# EAGLE schematic 85-2031 (EAGLE 6.6.0)
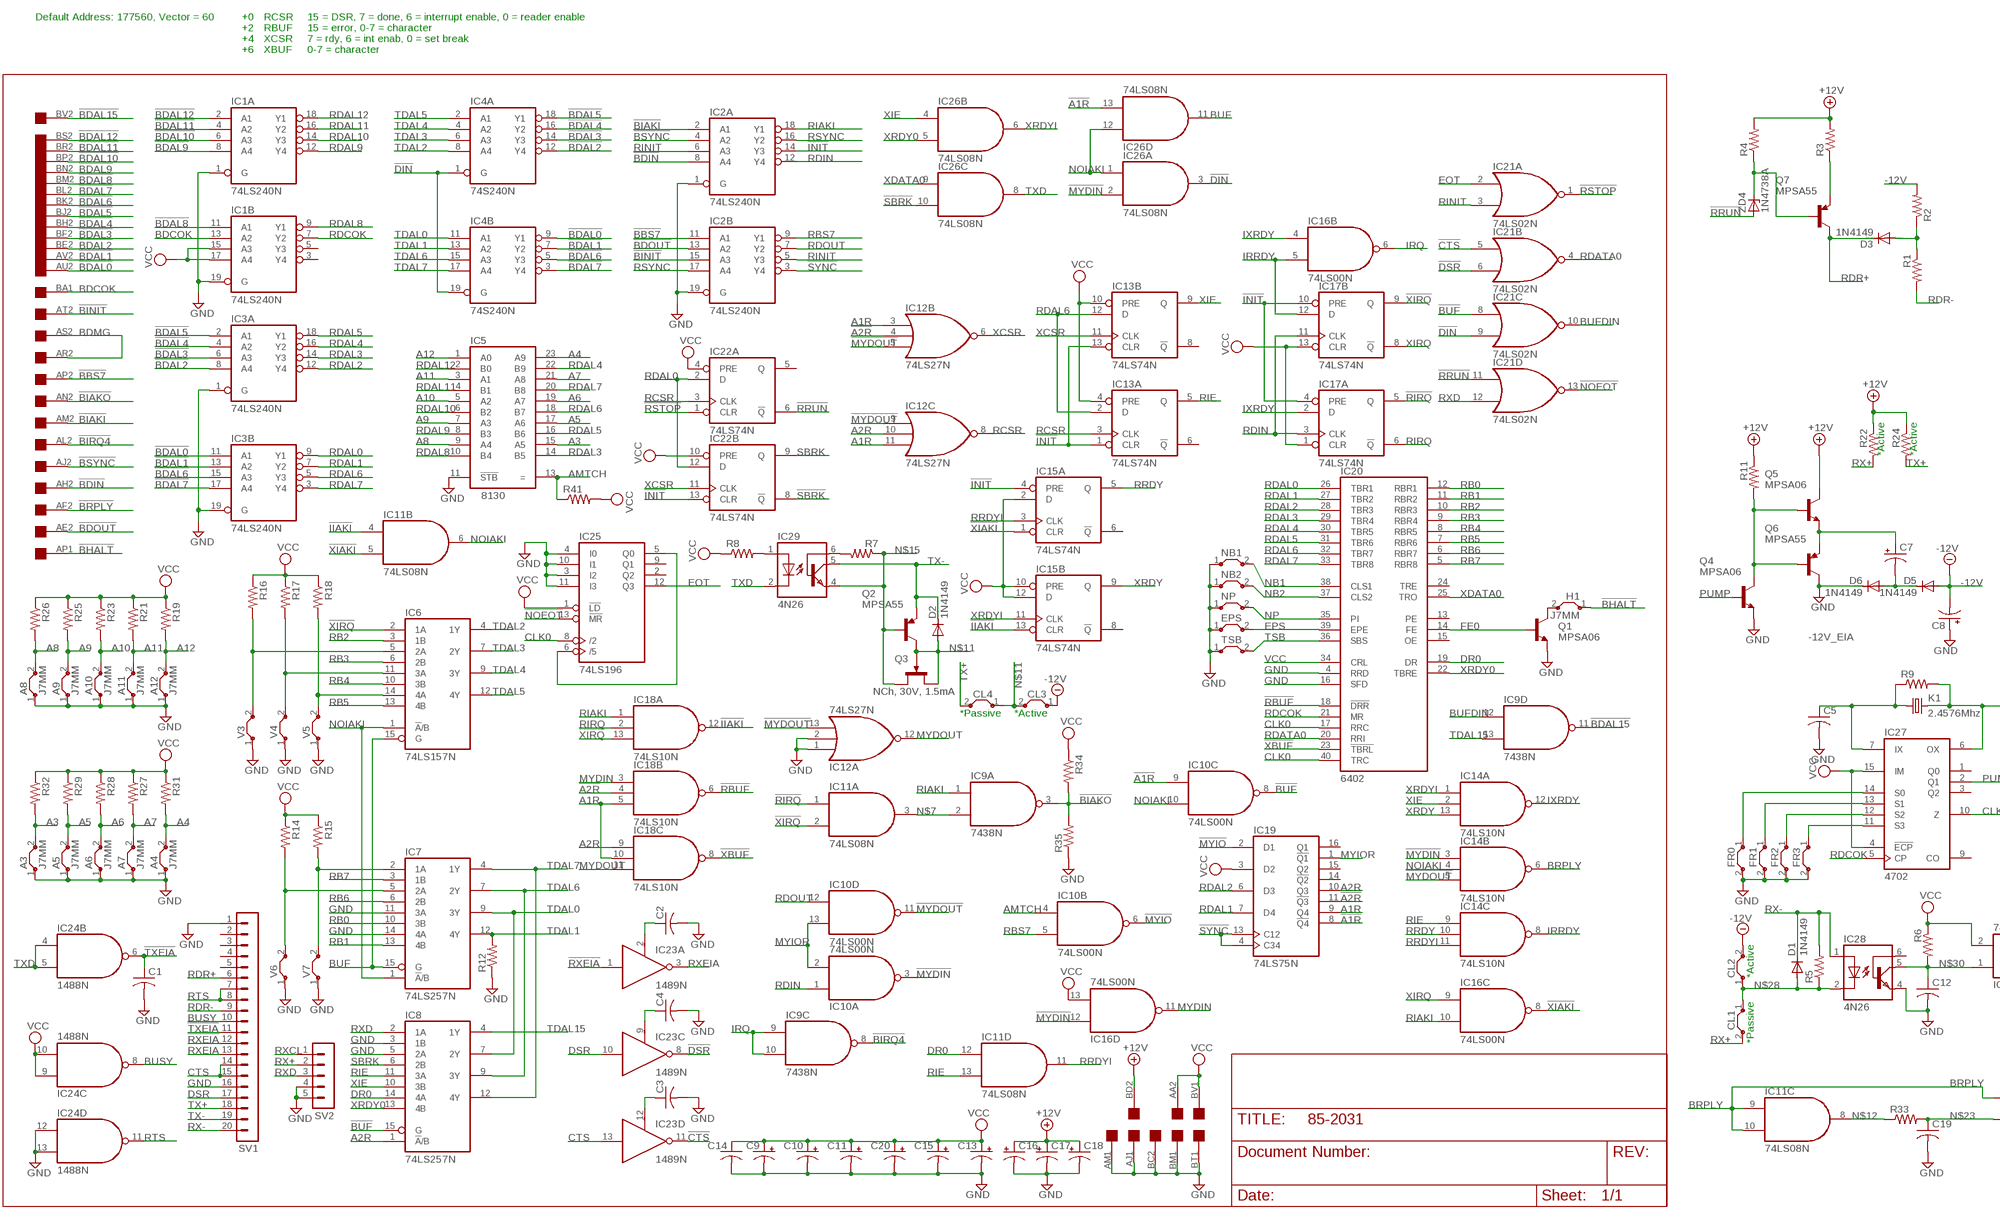
[diagram p0: schematic, sheet 1, part 1 of 2]
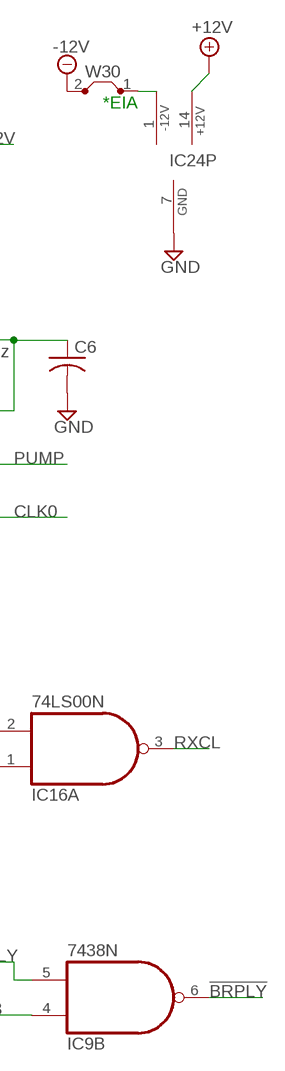
[diagram p1: schematic, sheet 1, part 2 of 2]

## Parts
A3  J7MM  [07]
A4  J7MM  [07]
A5  J7MM  [07]
A6  J7MM  [07]
A7  J7MM  [07]
A8  J7MM  [07]
A9  J7MM  [07]
A10  J7MM  [07]
A11  J7MM  [07]
A12  J7MM  [07]
C1  C-US075-032X103  [C075-032X103]
C2  C-US075-032X103  [C075-032X103]
C3  C-US075-032X103  [C075-032X103]
C4  C-US075-032X103  [C075-032X103]
C5  C-US075-032X103  [C075-032X103]
C6  C-US075-032X103  [C075-032X103]
C7  CPOL-USB45181B  [B45181B]
C8  CPOL-USB45181B  [B45181B]
C9  CPOL-USB45181B  [B45181B]
C10  CPOL-USB45181B  [B45181B]
C11  CPOL-USB45181B  [B45181B]
C12  C-US075-032X103  [C075-032X103]
C13  CPOL-USB45181B  [B45181B]
C14  C-US075-032X103  [C075-032X103]
C15  CPOL-USB45181B  [B45181B]
C16  CPOL-USB45181B  [B45181B]
C17  CPOL-USB45181B  [B45181B]
C18  CPOL-USB45181B  [B45181B]
C19  C-US075-032X103  [C075-032X103]
C20  CPOL-USB45181B  [B45181B]
CL1  J7MM  [07]
CL2  J7MM  [07]
CL3  J7MM  [07]
CL4  J7MM  [07]
D1  1N4149  1N4148DO35-10  [DO35-10]
D2  1N4149  1N4148DO35-10  [DO35-10]
D3  1N4149  1N4148DO35-10  [DO35-10]
D5  1N4149  1N4148DO35-10  [DO35-10]
D6  1N4149  1N4148DO35-10  [DO35-10]
EDGE$  DOUBLE  [EDGE-CON4]
EPS  J7MM  [07]
FR0  J7MM  [07]
FR1  J7MM  [07]
FR2  J7MM  [07]
FR3  J7MM  [07]
H1  J7MM  [07]
IC1  74LS240N  [DIL20]
IC2  74LS240N  [DIL20]
IC3  74LS240N  [DIL20]
IC4  74S240N  [DIL20]
IC5  8130  [DIL24]
IC6  74LS157N  [DIL16]
IC7  74LS257N  [DIL16]
IC8  74LS257N  [DIL16]
IC9  7438N  74LS38N  [DIL14]
IC10  74LS00N  [DIL14]
IC11  74LS08N  [DIL14]
IC12  74LS27N  [DIL14]
IC13  74LS74N  [DIL14]
IC14  74LS10N  [DIL14]
IC15  74LS74N  [DIL14]
IC16  74LS00N  [DIL14]
IC17  74LS74N  [DIL14]
IC18  74LS10N  [DIL14]
IC19  74LS75N  [DIL16]
IC20  6402  HD6402  [DIL40]
IC21  74LS02N  [DIL14]
IC22  74LS74N  [DIL14]
IC23  1489N  [DIL14]
IC24  1488N  [DIL14]
IC25  74LS196  [DIL14]
IC26  74LS08N  [DIL14]
IC27  4702  HD4702  [DIL16]
IC28  4N26  4N35  [DIL06]
IC29  4N26  4N35  [DIL06]
K1  2.4576Mhz  CRYSTALHC33U-H  [HC33U-H]
NB1  J7MM  [07]
NB2  J7MM  [07]
NP  J7MM  [07]
Q1  MPSA06  -NPN-TO92L  [TO92L]
Q2  MPSA55  -PNP-TO92L  [TO92L]
Q3  NCh, 30V, 1.5mA  2N4391  [TO18E]
Q4  MPSA06  -NPN-TO92L  [TO92L]
Q5  MPSA06  -NPN-TO92L  [TO92L]
Q6  MPSA55  -PNP-TO92L  [TO92L]
Q7  MPSA55  -PNP-TO92L  [TO92L]
R1  R-US_0207/10  [0207/10]
R2  R-US_0207/10  [0207/10]
R3  R-US_0207/10  [0207/10]
R4  R-US_0207/10  [0207/10]
R5  R-US_0207/10  [0207/10]
R6  R-US_0207/10  [0207/10]
R7  R-US_0207/10  [0207/10]
R8  R-US_0207/10  [0207/10]
R9  R-US_0207/10  [0207/10]
R11  R-US_0411/12  [0411/12]
R12  R-US_0207/10  [0207/10]
R14  R-US_0207/10  [0207/10]
R15  R-US_0207/10  [0207/10]
R16  R-US_0207/10  [0207/10]
R17  R-US_0207/10  [0207/10]
R18  R-US_0207/10  [0207/10]
R19  R-US_0207/10  [0207/10]
R21  R-US_0207/10  [0207/10]
R22  R-US_0207/10  [0207/10]
R23  R-US_0207/10  [0207/10]
R24  R-US_0207/10  [0207/10]
R25  R-US_0207/10  [0207/10]
R26  R-US_0207/10  [0207/10]
R27  R-US_0207/10  [0207/10]
R28  R-US_0207/10  [0207/10]
R29  R-US_0207/10  [0207/10]
R31  R-US_0207/10  [0207/10]
R32  R-US_0207/10  [0207/10]
R33  R-US_0207/10  [0207/10]
R34  R-US_0207/10  [0207/10]
R35  R-US_0207/10  [0207/10]
R41  R-US_0207/10  [0207/10]
SV1  MA20-1  [MA20-1]
SV2  MA05-1  [MA05-1]
TSB  J7MM  [07]
V3  J7MM  [07]
V4  J7MM  [07]
V5  J7MM  [07]
V6  J7MM  [07]
V7  J7MM  [07]
W30  J7MM  [07]
ZD4  1N4738A  1N4728  [DO41Z10]

## Nets
!A1R: IC10.9(C:I0) IC19.8(!Q4) IC26.13(D:I1)
!A2R: IC12.4(B:I1) IC18.4(B:I1) IC19.11(!Q3)
!BBS7: EDGE$.AP2 IC2.11(B:A1)
!BDAL0: EDGE$.AU2 IC3.11(B:A1) IC4.9(B:Y1)
!BDAL1: EDGE$.AV2 IC3.13(B:A2) IC4.7(B:Y2)
!BDAL2: EDGE$.BE2 IC3.8(A:A4) IC4.12(A:Y4)
!BDAL3: EDGE$.BF2 IC3.6(A:A3) IC4.14(A:Y3)
!BDAL4: EDGE$.BH2 IC3.4(A:A2) IC4.16(A:Y2)
!BDAL5: EDGE$.BJ2 IC3.2(A:A1) IC4.18(A:Y1)
!BDAL6: EDGE$.BK2 IC3.15(B:A3) IC4.5(B:Y3)
!BDAL7: EDGE$.BL2 IC3.17(B:A4) IC4.3(B:Y4)
!BDAL8: EDGE$.BM2 IC1.11(B:A1)
!BDAL9: EDGE$.BN2 IC1.8(A:A4)
!BDAL10: EDGE$.BP2 IC1.6(A:A3)
!BDAL11: EDGE$.BR2 IC1.4(A:A2)
!BDAL12: EDGE$.BS2 IC1.2(A:A1)
!BDAL15: EDGE$.BV2 IC9.11(D:O)
!BDIN: EDGE$.AH2 IC2.8(A:A4)
!BDOUT: EDGE$.AE2 IC2.13(B:A2)
!BHALT: EDGE$.AP1 H1.1
!BIAKI: EDGE$.AM2 IC2.2(A:A1)
!BIAKO: EDGE$.AN2 IC9.3(A:O) R34.2 R35.2
!BINIT: EDGE$.AT2 IC2.15(B:A3)
!BIRQ4: EDGE$.AL2 IC9.8(C:O)
!BRPLY: EDGE$.AF2 IC9.6(B:O)
!BSYNC: EDGE$.AJ2 IC2.4(A:A2)
!BUF: IC8.15(G) IC10.8(C:O) IC21.8(C:I0)
!CTS: IC21.5(B:I0) IC23.11(D:O)
!DIN: IC4.1(A:G) IC4.19(B:G) IC21.9(C:I1) IC26.3(A:O)
!DSR: IC21.6(B:I1) IC23.8(C:O)
!IIAKI: IC11.4(B:I0) IC15.13(B:CLR) IC18.12(A:O)
!INIT: IC2.14(A:Y3) IC13.1(A:CLR) IC13.13(B:CLR) IC15.4(A:PRE) IC17.4(A:PRE) IC17.10(B:PRE) IC22.13(B:CLR)
!MYDIN: IC10.3(A:O) IC14.3(B:I0) IC16.12(D:I0) IC26.2(A:I1)
!MYDOUT: IC10.11(D:O) IC12.5(B:I2) IC12.9(C:I0) IC12.13(A:I2) IC14.5(B:I2)
!MYIO: IC10.6(B:O) IC19.2(D1)
!NOEOT: IC21.13(D:O) IC25.13(!MR)
!RBUF: IC18.6(B:O) IC20.18(!DRR)
!RIRQ: IC11.1(A:I0) IC17.5(A:Q)
!RRUN: IC21.11(D:I0) IC22.6(A:!Q) ZD4.A
!RSTOP: IC21.1(A:O) IC22.1(A:CLR)
!RXEIA: IC23.1(A:I) SV1.12
!SBRK: IC22.8(B:!Q) IC26.10(C:I1)
!SYNC: IC2.3(B:Y4) IC19.4(C34) IC19.13(C12)
!TXEIA: C1.1 IC24.6(B:O) SV1.11
!XBUF: IC18.8(C:O) IC20.23(!TBRL)
!XIAKI: IC11.5(B:I1) IC15.1(A:CLR) IC16.8(C:O)
!XIRQ: IC6.2(1A) IC11.2(A:I1) IC17.9(B:Q) IC18.13(A:I2)
+12V [Supply]: C16.+ C17.+ C18.+ EDGE$.BD2 IC24.14(P:+12V) Q5.3(C) R3.2 R4.2 R11.1 R22.1 R24.1
-12V: C8.- CL2.2 CL3.1 D5.A R2.2 W30.2
-12V_EIA: IC24.1(P:-12V) W30.1
A1R: IC12.3(B:I0) IC12.11(C:I2) IC18.5(B:I2) IC18.10(C:I1) IC19.9(Q4)
A2R: IC8.1(!A!/B) IC12.10(C:I1) IC18.9(C:I0) IC19.10(Q3)
A3: A3.2 IC5.15(A5) R32.2
A4: A4.2 IC5.23(A9) R31.2
A5: A5.2 IC5.17(A6) R29.2
A6: A6.2 IC5.19(A7) R28.2
A7: A7.2 IC5.21(A8) R27.2
A8: A8.2 IC5.9(A4) R26.2
A9: A9.2 IC5.7(A3) R25.2
A10: A10.2 IC5.5(A2) R23.2
A11: A11.2 IC5.3(A1) R21.2
A12: A12.2 IC5.1(A0) R19.2
AMTCH: IC5.13(=) IC10.4(B:I0) R41.1
BDCOK: EDGE$.BA1 IC1.13(B:A2)
BDMG: EDGE$.AR2 EDGE$.AS2
BRPLY: IC9.5(B:I1) IC11.9(C:I0) IC11.10(C:I1) IC14.6(B:O)
BUF: IC6.15(G) IC7.15(G) IC26.11(D:O)
BUFDIN: IC9.12(D:I0) IC21.10(C:O)
BUSY: IC24.8(C:O) SV1.10
CLK0: IC20.17(RRC) IC20.40(TRC) IC25.8(/2) IC27.10(Z)
CTS: IC23.13(D:I) SV1.14 SV1.15
DR0: IC8.14(4A) IC11.12(D:I0) IC20.19(DR)
DSR: IC23.10(C:I) SV1.17
EOT: IC21.2(A:I0) IC25.12(Q3)
EPS: EPS.2 IC20.39(EPE)
FE0: IC20.14(FE) Q1.2(B)
GND [Supply]: A3.1 A4.1 A5.1 A6.1 A7.1 A8.1 A9.1 A10.1 A11.1 A12.1 C1.2 C2.2 C3.2 C4.2 C5.2 C6.2 C8.+ C9.- C10.- C11.- C12.2 C13.- C14.2 C15.- C16.- C17.- C18.- C19.2 C20.- D6.C EDGE$.AJ1 EDGE$.AM1 EDGE$.BC2 EDGE$.BM1 EDGE$.BT1 EPS.1 FR0.2 FR1.2 FR2.2 FR3.2 IC1.1(A:G) IC1.19(B:G) IC2.1(A:G) IC2.19(B:G) IC3.1(A:G) IC3.19(B:G) IC5.11(!STB) IC7.11(3A) IC7.14(4A) IC8.3(1B) IC8.5(2A) IC12.1(A:I0) IC12.2(A:I1) IC20.4(RRD) IC20.16(SFD) IC24.7(P:GND) IC24.12(D:I0) IC24.13(D:I1) IC25.3(I2) IC25.4(I0) IC25.10(I1) IC25.11(I3) IC28.4(EMI) NB1.1 NB2.1 NP.1 Q1.1(E) Q4.1(E) Q6.3(C) R12.1 R35.1 SV1.1 SV1.16 SV2.4 SV2.5 TSB.1 V3.1 V4.1 V5.1 V6.1 V7.1
IRQ: IC9.9(C:I0) IC9.10(C:I1) IC16.6(B:O)
IRRDY: IC14.8(C:O) IC16.5(B:I1) IC17.12(B:D)
IXRDY: IC14.12(A:O) IC16.4(B:I0) IC17.2(A:D)
MYDIN: IC16.11(D:O) IC18.3(B:I0)
MYDOUT: IC12.12(A:O) IC18.11(C:I2)
MYIOR: IC10.2(A:I1) IC10.13(D:I1) IC19.1(!Q1)
N$1: C2.1 IC23.2(A:RC)
N$2: FR0.1 IC27.14(S0)
N$3: H1.2 Q1.3(C)
N$4: FR1.1 IC27.13(S1)
N$5: FR2.1 IC27.12(S2)
N$6: FR3.1 IC27.11(S3)
N$7: IC9.2(A:I1) IC11.3(A:O)
N$8: IC6.14(4A) R18.2 V5.2
N$9: C5.1 IC27.7(IX) K1.1 R9.1
N$10: C6.1 IC27.6(OX) K1.2 R9.2
N$11: CL3.2 CL4.1 D2.A Q2.3(C) Q3.D Q3.G
N$12: IC11.8(C:O) R33.1
N$13: IC29.6(BAS) R7.2
N$15: IC29.4(EMI) Q2.2(B) Q3.S R7.1
N$16: IC29.1(A) R8.2
N$17: IC7.2(1A) R15.2 V7.2
N$18: IC7.5(2A) R14.2 V6.2
N$19: C4.1 IC23.9(C:RC)
N$20: C7.- D5.C D6.A
N$21: IC6.11(3A) R17.2 V4.2
N$22: C7.+ Q5.1(E) Q6.1(E)
N$23: C19.1 IC9.4(B:I0) R33.2
N$24: IC6.5(2A) R16.2 V3.2
N$25: C3.1 IC23.12(D:RC)
N$26: Q4.3(C) Q5.2(B) Q6.2(B) R11.2
N$27: D3.A R1.1 R2.1
N$28: CL1.1 CL2.1 D1.A IC28.2(C) R5.1
N$29: Q7.2(B) R4.1 ZD4.C
N$30: C12.1 IC16.1(A:I0) IC28.5(COL) R6.2
N$31: Q7.1(E) R3.1
N$32: IC25.5(Q0) IC25.6(/5)
NB1: IC20.38(CLS1) NB1.2
NB2: IC20.37(CLS2) NB2.2
NOIAKI: IC6.1(!A!/B) IC7.1(!A!/B) IC10.10(C:I1) IC11.6(B:O) IC14.4(B:I1) IC26.1(A:I0) IC26.12(D:I0)
NP: IC20.35(PI) NP.2
PUMP: IC27.2(Q1) Q4.2(B)
RB0: IC7.10(3B) IC20.12(RBR1)
RB1: IC7.13(4B) IC20.11(RBR2)
RB2: IC6.3(1B) IC20.10(RBR3)
RB3: IC6.6(2B) IC20.9(RBR4)
RB4: IC6.10(3B) IC20.8(RBR5)
RB5: IC6.13(4B) IC20.7(RBR6)
RB6: IC7.6(2B) IC20.6(RBR7)
RB7: IC7.3(1B) IC20.5(RBR8)
RBS7: IC2.9(B:Y1) IC10.5(B:I1)
RCSR: IC12.8(C:O) IC13.3(A:CLK) IC22.3(A:CLK)
RDAL0: IC3.9(B:Y1) IC20.26(TBR1) IC22.2(A:D) IC22.12(B:D)
RDAL1: IC3.7(B:Y2) IC19.7(D4) IC20.27(TBR2)
RDAL2: IC3.12(A:Y4) IC19.6(D3) IC20.28(TBR3)
RDAL3: IC3.14(A:Y3) IC5.14(B5) IC20.29(TBR4)
RDAL4: IC3.16(A:Y2) IC5.22(B9) IC20.30(TBR5)
RDAL5: IC3.18(A:Y1) IC5.16(B6) IC20.31(TBR6)
RDAL6: IC3.5(B:Y3) IC5.18(B7) IC13.2(A:D) IC13.12(B:D) IC20.32(TBR7)
RDAL7: IC3.3(B:Y4) IC5.20(B8) IC20.33(TBR8)
RDAL8: IC1.9(B:Y1) IC5.10(B4)
RDAL9: IC1.12(A:Y4) IC5.8(B3)
RDAL10: IC1.14(A:Y3) IC5.6(B2)
RDAL11: IC1.16(A:Y2) IC5.4(B1)
RDAL12: IC1.18(A:Y1) IC5.2(B0)
RDATA0: IC20.20(RRI) IC21.4(B:O)
RDCOK: IC1.7(B:Y2) IC20.21(MR) IC27.5(CP)
RDIN: IC2.12(A:Y4) IC10.1(A:I0) IC17.3(A:CLK) IC17.11(B:CLK)
RDOUT: IC2.7(B:Y2) IC10.12(D:I0)
RDR+: D3.C Q7.3(C) SV1.6
RDR-: R1.2 SV1.9
RIAKI: IC2.18(A:Y1) IC9.1(A:I0) IC16.10(C:I1) IC18.1(A:I0)
RIE: IC8.11(3A) IC11.13(D:I1) IC13.5(A:Q) IC14.9(C:I0)
RINIT: IC2.5(B:Y3) IC2.6(A:A3) IC21.3(A:I1)
RIRQ: IC17.6(A:!Q) IC18.2(A:I1)
RRDY: IC14.10(C:I1) IC15.5(A:Q)
RRDYI: IC11.11(D:O) IC14.11(C:I2) IC15.3(A:CLK)
RSYNC: IC2.16(A:Y2) IC2.17(B:A4)
RTS: IC24.11(D:O) SV1.7 SV1.8
RX+: CL1.2 R22.2 SV2.2
RX-: D1.C IC28.1(A) R5.2 SV1.20
RXCL: IC16.3(A:O) SV2.1
RXD: IC8.2(1A) IC21.12(D:I1) SV2.3
RXEIA: IC23.3(A:O) SV1.13
SBRK: IC8.6(2B) IC22.9(B:Q)
TDAL0: IC4.11(B:A1) IC7.9(3Y) IC8.7(2Y)
TDAL1: IC4.13(B:A2) IC7.12(4Y) R12.2
TDAL2: IC4.8(A:A4) IC6.4(1Y)
TDAL3: IC4.6(A:A3) IC6.7(2Y)
TDAL4: IC4.4(A:A2) IC6.9(3Y)
TDAL5: IC4.2(A:A1) IC6.12(4Y)
TDAL6: IC4.15(B:A3) IC7.7(2Y) IC8.9(3Y)
TDAL7: IC4.17(B:A4) IC7.4(1Y) IC8.12(4Y)
TDAL15: IC8.4(1Y) IC9.13(D:I1)
TSB: IC20.36(SBS) TSB.2
TX+: CL4.2 R24.2 SV1.18
TX-: D2.C IC29.5(COL) Q2.1(E) SV1.19
TXD: IC24.4(B:I0) IC24.5(B:I1) IC26.8(C:O) IC29.2(C)
VCC: C9.+ C10.+ C11.+ C13.+ C14.1 C15.+ C20.+ EDGE$.AA2 EDGE$.BV1 IC1.15(B:A3) IC1.17(B:A4) IC13.4(A:PRE) IC13.10(B:PRE) IC15.2(A:D) IC15.10(B:PRE) IC15.12(B:D) IC16.2(A:I1) IC16.13(D:I1) IC17.1(A:CLR) IC17.13(B:CLR) IC19.3(D2) IC20.34(CRL) IC22.4(A:PRE) IC22.10(B:PRE) IC24.9(C:I0) IC24.10(C:I1) IC25.1(!LD) IC27.4(!ECP) IC27.15(IM) R6.1 R8.1 R14.1 R15.1 R16.1 R17.1 R18.1 R19.1 R21.1 R23.1 R25.1 R26.1 R27.1 R28.1 R29.1 R31.1 R32.1 R34.1 R41.2
XCSR: IC12.6(B:O) IC13.11(B:CLK) IC22.11(B:CLK)
XDATA0: IC20.25(TRO) IC26.9(C:I0)
XIE: IC8.10(3B) IC13.9(B:Q) IC14.2(A:I1) IC26.4(B:I0)
XIRQ: IC16.9(C:I0) IC17.8(B:!Q)
XRDY: IC14.13(A:I2) IC15.9(B:Q)
XRDY0: IC8.13(4B) IC20.22(TBRE) IC26.5(B:I1)
XRDYI: IC14.1(A:I0) IC15.11(B:CLK) IC26.6(B:O)
Unconnected: EDGE$.AA1 EDGE$.AB1 EDGE$.AB2 EDGE$.AC1 EDGE$.AC2 EDGE$.AD1 EDGE$.AD2 EDGE$.AE1 EDGE$.AF1 EDGE$.AH1 EDGE$.AK1 EDGE$.AK2 EDGE$.AL1 EDGE$.AN1 EDGE$.AR1 EDGE$.AS1 EDGE$.AT1 EDGE$.AU1 EDGE$.AV1 EDGE$.BA2 EDGE$.BB1 EDGE$.BB2 EDGE$.BC1 EDGE$.BD1 EDGE$.BE1 EDGE$.BF1 EDGE$.BH1 EDGE$.BJ1 EDGE$.BK1 EDGE$.BL1 EDGE$.BN1 EDGE$.BP1 EDGE$.BR1 EDGE$.BS1 EDGE$.BT2 EDGE$.BU1 EDGE$.BU2 IC1.3(B:Y4) IC1.5(B:Y3) IC13.6(A:!Q) IC13.8(B:!Q) IC15.6(A:!Q) IC15.8(B:!Q) IC19.14(!Q2) IC19.15(Q2) IC19.16(Q1) IC20.13(PE) IC20.15(OE) IC20.24(TRE) IC22.5(A:Q) IC23.4(B:I) IC23.5(B:RC) IC23.6(B:O) IC24.2(A:I) IC24.3(A:O) IC25.2(Q2) IC25.9(Q1) IC27.1(Q0) IC27.3(Q2) IC27.9(CO) IC28.6(BAS) SV1.2 SV1.3 SV1.4 SV1.5

## Notes on the sheet
- Default Address: 177560, Vector = 60 | +0 | RCSR | 15 = DSR, 7 = done, 6 = interrupt enable, 0 = reader enable
- +2 | RBUF | 15 = error, 0-7 = character
- +4 | XCSR | 7 = rdy, 6 = int enab, 0 = set break
- +6 | XBUF | 0-7 = character
- *Active | *Active
- *EIA
- *Passive | *Active
- *Active
- *Passive

## Power pins joined to a net without a drawn wire
GND: IC1.10(P:GND) IC2.10(P:GND) IC3.10(P:GND) IC4.10(P:GND) IC5.12(GND) IC6.8(GND) IC7.8(GND) IC8.8(GND) IC9.7(P:GND) IC10.7(P:GND) IC11.7(P:GND) IC12.7(P:GND) IC13.7(P:GND) IC14.7(P:GND) IC15.7(P:GND) IC16.7(P:GND) IC17.7(P:GND) IC18.7(P:GND) IC19.12(GND) IC20.3(GND) IC21.7(P:GND) IC22.7(P:GND) IC23.7(P:GND) IC25.7(GND) IC26.7(P:GND) IC27.8(GND)
VCC: IC1.20(P:VCC) IC2.20(P:VCC) IC3.20(P:VCC) IC4.20(P:VCC) IC5.24(VCC) IC6.16(VCC) IC7.16(VCC) IC8.16(VCC) IC9.14(P:VCC) IC10.14(P:VCC) IC11.14(P:VCC) IC12.14(P:VCC) IC13.14(P:VCC) IC14.14(P:VCC) IC15.14(P:VCC) IC16.14(P:VCC) IC17.14(P:VCC) IC18.14(P:VCC) IC19.5(VCC) IC20.1(VCC) IC21.14(P:VCC) IC22.14(P:VCC) IC23.14(P:VCC) IC25.14(VCC) IC26.14(P:VCC) IC27.16(VCC)

## Library data of the parts
A3-A12 CL1-CL4 EPS FR0 FR1-FR3 H1 NB1 NB2 NP TSB V3-V7 W30 = jumper:J: Bridge
C1-C6 C12 C14 C19 = rcl:C-US: CAPACITOR, American symbol
C7-C11 C13 C15-C18 C20 = rcl:CPOL-US: POLARIZED CAPACITOR, American symbol
D1-D3 D5 D6 = diode:1N4148: DIODE high speed (Philips)
EDGE$ = dec-con:DOUBLE: Double-Height DEC board
IC1-IC4 = 74xx-us:74*240: Octal BUFFER and LINE DRIVER, 3-state
IC5 = dec-con:8130: 10 bit comparator
IC6 = 74xx-us:74*157: Quadruple 2-line to 1-line data SELECTOR/MULTIPLEXER
IC7 IC8 = 74xx-us:74*257: Quadruple 2-to 1 line data SELECTOR/MULTIPLEXER
IC9 = dec-con:74*38: Quad 2-input NAND gate, open collector output
IC10 IC16 = 74xx-us:74*00: Quad 2-input NAND gate
IC11 IC26 = 74xx-us:74*08: Quad 2-input AND gate
IC12 = 74xx-us:74*27: Triple 3-input NOR gate
IC13 IC15 IC17 IC22 = 74xx-us:74*74: Dual D type positive edge triggered FLIP FLOP, preset and clear
IC14 IC18 = 74xx-us:74*10: Triple 3-input NAND gate
IC19 = 74xx-us:74*75: 4-bit bistable LATCH
IC20 = micro-harris:HD6402: MICROCONTROLLER/MEMORY DEVICE; OC_FARNELL: unknown; OC_NEWARK: unknown
IC21 = 74xx-us:74*02: Quad 2-input NOR gate
IC23 = dec-con:14*89: Quad line receivers BUFFER,
IC24 = dec-con:14*88: Quad 2-input NAND gate
IC25 = dec-con:74LS196: Loadable decade counter
IC27 = micro-harris:HD4702: MICROCONTROLLER/MEMORY DEVICE; OC_FARNELL: unknown; OC_NEWARK: unknown
IC28 IC29 = optocoupler:4N35: MOTOROLA OPTO COUPLER; MF: FAIRCHILD SEMICONDUCTOR; MPN: 4N35; OC_FARNELL: 1328375; OC_NEWARK: 72K9946
K1 = crystal:CRYSTAL: CRYSTAL; OC_FARNELL: unknown; OC_NEWARK: unknown
Q1 Q4 Q5 = transistor:*-NPN-: NPN Transistror BF959 corrected 2008.03.06
Q2 Q6 Q7 = transistor:*-PNP-: PNP Transistror
Q3 = transistor-small-signal:2N4391: N-CHANNEL FET
R1-R9 R11 R12 R14-R19 R21-R29 R31-R35 R41 = rcl:R-US_: RESISTOR, American symbol
SV1 = con-lstb:MA20-1: PIN HEADER; OC_FARNELL: unknown; OC_NEWARK: unknown
SV2 = con-lstb:MA05-1: PIN HEADER; OC_FARNELL: unknown; OC_NEWARK: unknown
ZD4 = diode:1N4728: Z DIODE 3.3 V, 1W, 5 percent

## Net classes
1 Supply: width 0.635 mm